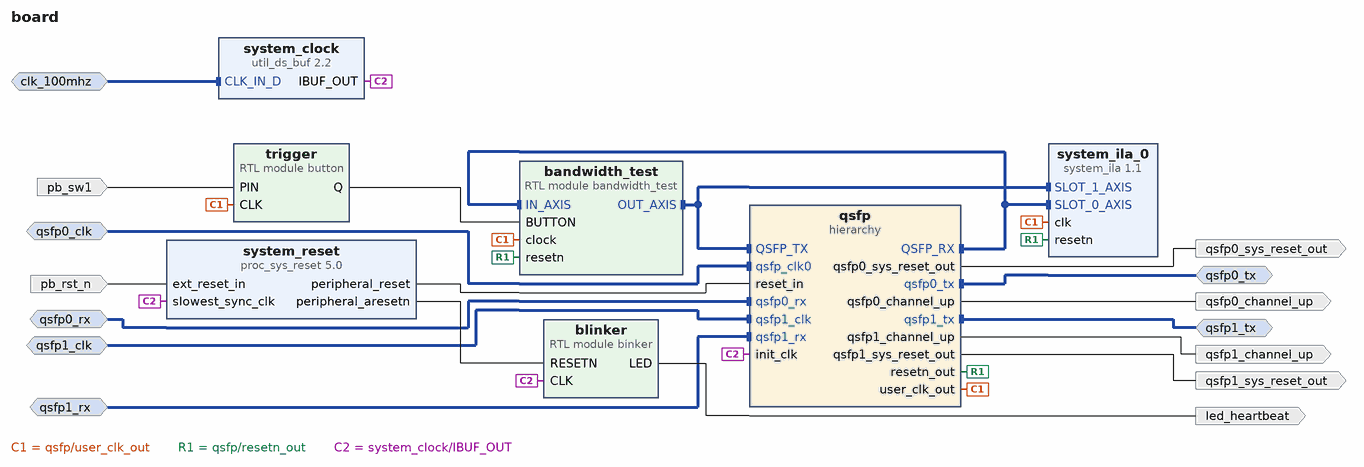
[diagram p0: block diagram of the top level]
# Vivado block design board, xczu19eg-ffvc1760-2-i, Vivado 2021.1
create_bd_design board

create_bd_intf_port -mode Slave -vlnv xilinx.com:interface:diff_clock_rtl:1.0 clk_100mhz
create_bd_intf_port -mode Slave -vlnv xilinx.com:interface:diff_clock_rtl:1.0 qsfp1_clk
set_property -dict {CONFIG.FREQ_HZ 322265625} [get_bd_intf_ports qsfp1_clk]
create_bd_intf_port -mode Slave -vlnv xilinx.com:display_aurora:GT_Serial_Transceiver_Pins_RX_rtl:1.0 qsfp1_rx
create_bd_intf_port -mode Master -vlnv xilinx.com:display_aurora:GT_Serial_Transceiver_Pins_TX_rtl:1.0 qsfp1_tx
create_bd_intf_port -mode Slave -vlnv xilinx.com:interface:diff_clock_rtl:1.0 qsfp0_clk
set_property -dict {CONFIG.FREQ_HZ 322265625} [get_bd_intf_ports qsfp0_clk]
create_bd_intf_port -mode Master -vlnv xilinx.com:display_aurora:GT_Serial_Transceiver_Pins_TX_rtl:1.0 qsfp0_tx
create_bd_intf_port -mode Slave -vlnv xilinx.com:display_aurora:GT_Serial_Transceiver_Pins_RX_rtl:1.0 qsfp0_rx
create_bd_port -dir O led_heartbeat
create_bd_port -dir I -type rst pb_rst_n
create_bd_port -dir O qsfp1_channel_up
create_bd_port -dir O -type rst qsfp1_sys_reset_out
set_property -dict {CONFIG.POLARITY ACTIVE_HIGH} [get_bd_ports qsfp1_sys_reset_out]
create_bd_port -dir O -type rst qsfp0_sys_reset_out
set_property -dict {CONFIG.POLARITY ACTIVE_HIGH} [get_bd_ports qsfp0_sys_reset_out]
create_bd_port -dir O qsfp0_channel_up
create_bd_port -dir I pb_sw1

create_bd_cell -type ip -vlnv xilinx.com:ip:util_ds_buf:2.2 system_clock
create_bd_cell -type module -reference binker blinker
create_bd_cell -type ip -vlnv xilinx.com:ip:proc_sys_reset:5.0 system_reset
create_bd_cell -type module -reference button trigger
create_bd_cell -type module -reference bandwidth_test bandwidth_test
create_bd_cell -type hier qsfp
create_bd_cell -type ip -vlnv xilinx.com:ip:system_ila:1.1 system_ila_0
set_property -dict [list \
  CONFIG.C_MON_TYPE INTERFACE \
  CONFIG.C_NUM_MONITOR_SLOTS 2 \
  CONFIG.C_SLOT_0_APC_EN 0 \
  CONFIG.C_SLOT_0_AXI_DATA_SEL 1 \
  CONFIG.C_SLOT_0_AXI_TRIG_SEL 1 \
  CONFIG.C_SLOT_0_INTF_TYPE xilinx.com:interface:axis_rtl:1.0 \
  CONFIG.C_SLOT_1_APC_EN 0 \
  CONFIG.C_SLOT_1_AXI_DATA_SEL 1 \
  CONFIG.C_SLOT_1_AXI_TRIG_SEL 1 \
  CONFIG.C_SLOT_1_INTF_TYPE xilinx.com:interface:axis_rtl:1.0 \
] [get_bd_cells system_ila_0]

# ---- hierarchy /qsfp ----
current_bd_instance /qsfp
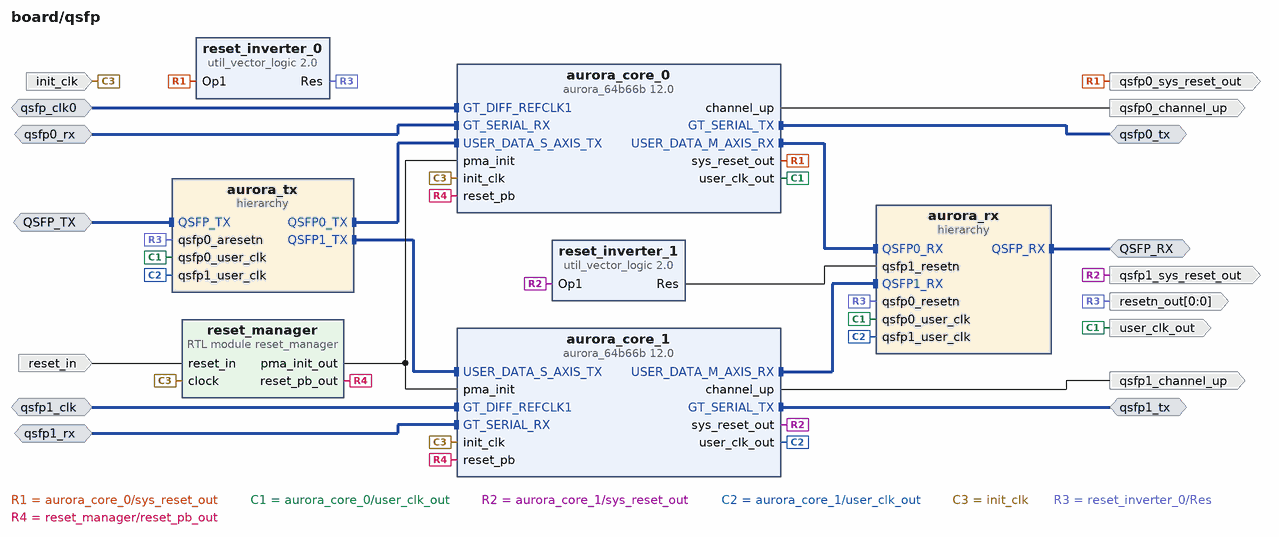
[diagram p1: block diagram inside /qsfp]
create_bd_intf_pin -mode Slave -vlnv xilinx.com:interface:diff_clock_rtl:1.0 qsfp_clk0
create_bd_intf_pin -mode Master -vlnv xilinx.com:display_aurora:GT_Serial_Transceiver_Pins_TX_rtl:1.0 qsfp0_tx
create_bd_intf_pin -mode Slave -vlnv xilinx.com:display_aurora:GT_Serial_Transceiver_Pins_RX_rtl:1.0 qsfp0_rx
create_bd_intf_pin -mode Master -vlnv xilinx.com:display_aurora:GT_Serial_Transceiver_Pins_TX_rtl:1.0 qsfp1_tx
create_bd_intf_pin -mode Slave -vlnv xilinx.com:display_aurora:GT_Serial_Transceiver_Pins_RX_rtl:1.0 qsfp1_rx
create_bd_intf_pin -mode Slave -vlnv xilinx.com:interface:diff_clock_rtl:1.0 qsfp1_clk
create_bd_intf_pin -mode Slave -vlnv xilinx.com:interface:axis_rtl:1.0 QSFP_TX
create_bd_intf_pin -mode Master -vlnv xilinx.com:interface:axis_rtl:1.0 QSFP_RX
create_bd_pin -dir I -type clk init_clk
create_bd_pin -dir O qsfp0_channel_up
create_bd_pin -dir O -type rst qsfp0_sys_reset_out
create_bd_pin -dir O -type clk user_clk_out
create_bd_pin -dir I -type rst reset_in
create_bd_pin -dir O -from 0 -to 0 resetn_out
create_bd_pin -dir O -type rst qsfp1_sys_reset_out
create_bd_pin -dir O qsfp1_channel_up

create_bd_cell -type ip -vlnv xilinx.com:ip:aurora_64b66b:12.0 aurora_core_0
set_property -dict [list \
  CONFIG.CHANNEL_ENABLE {X0Y12 X0Y13 X0Y14 X0Y15} \
  CONFIG.C_AURORA_LANES 4 \
  CONFIG.C_GT_CLOCK_1 GTYQ0 \
  CONFIG.C_GT_TYPE GTY \
  CONFIG.C_LINE_RATE 25.78125 \
  CONFIG.C_REFCLK_FREQUENCY 322.265625 \
  CONFIG.C_REFCLK_SOURCE MGTREFCLK0_of_Quad_X0Y3 \
  CONFIG.C_START_LANE X0Y12 \
  CONFIG.C_START_QUAD Quad_X0Y3 \
  CONFIG.C_UCOLUMN_USED left \
  CONFIG.SupportLevel 1 \
  CONFIG.drp_mode Disabled \
  CONFIG.interface_mode Streaming \
] [get_bd_cells aurora_core_0]
create_bd_cell -type module -reference reset_manager reset_manager
create_bd_cell -type ip -vlnv xilinx.com:ip:util_vector_logic:2.0 reset_inverter_0
set_property -dict {CONFIG.C_OPERATION not CONFIG.C_SIZE 1} [get_bd_cells reset_inverter_0]
create_bd_cell -type ip -vlnv xilinx.com:ip:aurora_64b66b:12.0 aurora_core_1
set_property -dict [list \
  CONFIG.CHANNEL_ENABLE {X0Y16 X0Y17 X0Y18 X0Y19} \
  CONFIG.C_AURORA_LANES 4 \
  CONFIG.C_GT_CLOCK_1 GTYQ0 \
  CONFIG.C_GT_TYPE GTY \
  CONFIG.C_LINE_RATE 25.78125 \
  CONFIG.C_REFCLK_FREQUENCY 322.265625 \
  CONFIG.C_REFCLK_SOURCE MGTREFCLK0_of_Quad_X0Y4 \
  CONFIG.C_START_LANE X0Y16 \
  CONFIG.C_START_QUAD Quad_X0Y4 \
  CONFIG.C_UCOLUMN_USED left \
  CONFIG.SupportLevel 1 \
  CONFIG.TransceiverControl false \
  CONFIG.drp_mode Disabled \
  CONFIG.interface_mode Streaming \
] [get_bd_cells aurora_core_1]
create_bd_cell -type ip -vlnv xilinx.com:ip:util_vector_logic:2.0 reset_inverter_1
set_property -dict {CONFIG.C_OPERATION not CONFIG.C_SIZE 1} [get_bd_cells reset_inverter_1]
create_bd_cell -type hier aurora_tx
create_bd_cell -type hier aurora_rx

# ---- hierarchy /qsfp/aurora_tx ----
current_bd_instance /qsfp/aurora_tx
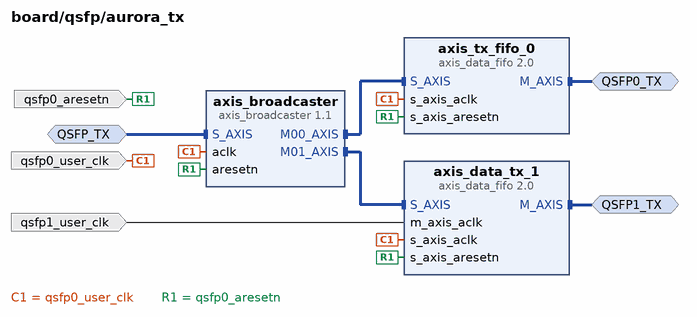
[diagram p2: block diagram inside /qsfp/aurora_tx]
create_bd_intf_pin -mode Master -vlnv xilinx.com:interface:axis_rtl:1.0 QSFP1_TX
create_bd_intf_pin -mode Master -vlnv xilinx.com:interface:axis_rtl:1.0 QSFP0_TX
create_bd_intf_pin -mode Slave -vlnv xilinx.com:interface:axis_rtl:1.0 QSFP_TX
create_bd_pin -dir I -type rst qsfp0_aresetn
create_bd_pin -dir I -type clk qsfp0_user_clk
create_bd_pin -dir I -type clk qsfp1_user_clk

create_bd_cell -type ip -vlnv xilinx.com:ip:axis_data_fifo:2.0 axis_data_tx_1
set_property -dict {CONFIG.IS_ACLK_ASYNC 1} [get_bd_cells axis_data_tx_1]
create_bd_cell -type ip -vlnv xilinx.com:ip:axis_data_fifo:2.0 axis_tx_fifo_0
create_bd_cell -type ip -vlnv xilinx.com:ip:axis_broadcaster:1.1 axis_broadcaster
set_property -dict [list \
  CONFIG.M00_TDATA_REMAP {tdata[511:256]} \
  CONFIG.M01_TDATA_REMAP {tdata[255:0]} \
  CONFIG.M_TDATA_NUM_BYTES 32 \
] [get_bd_cells axis_broadcaster]

# ---- hierarchy /qsfp/aurora_rx ----
current_bd_instance /qsfp/aurora_rx
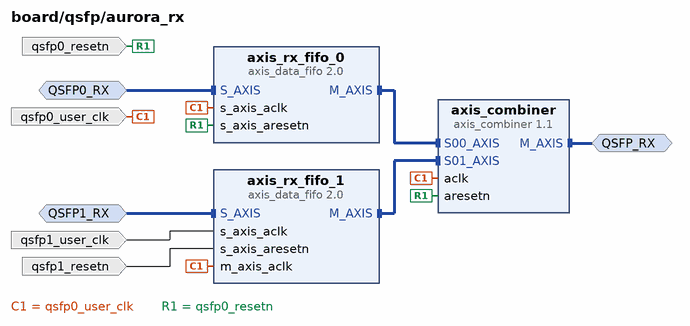
[diagram p3: block diagram inside /qsfp/aurora_rx]
create_bd_intf_pin -mode Master -vlnv xilinx.com:interface:axis_rtl:1.0 QSFP_RX
create_bd_intf_pin -mode Slave -vlnv xilinx.com:interface:axis_rtl:1.0 QSFP0_RX
create_bd_intf_pin -mode Slave -vlnv xilinx.com:interface:axis_rtl:1.0 QSFP1_RX
create_bd_pin -dir I -type clk qsfp0_user_clk
create_bd_pin -dir I -type rst qsfp0_resetn
create_bd_pin -dir I -type rst qsfp1_resetn
create_bd_pin -dir I -type clk qsfp1_user_clk

create_bd_cell -type ip -vlnv xilinx.com:ip:axis_combiner:1.1 axis_combiner
create_bd_cell -type ip -vlnv xilinx.com:ip:axis_data_fifo:2.0 axis_rx_fifo_0
create_bd_cell -type ip -vlnv xilinx.com:ip:axis_data_fifo:2.0 axis_rx_fifo_1
set_property -dict {CONFIG.IS_ACLK_ASYNC 1} [get_bd_cells axis_rx_fifo_1]

# ---- connections ----

current_bd_instance /qsfp
connect_bd_intf_net [get_bd_intf_pins qsfp_clk0] [get_bd_intf_pins aurora_core_0/GT_DIFF_REFCLK1]
connect_bd_intf_net -intf_net Conn2 [get_bd_intf_pins QSFP_TX] [get_bd_intf_pins aurora_tx/QSFP_TX]
connect_bd_intf_net -intf_net Conn3 [get_bd_intf_pins QSFP_RX] [get_bd_intf_pins aurora_rx/QSFP_RX]
connect_bd_intf_net [get_bd_intf_pins qsfp0_tx] [get_bd_intf_pins aurora_core_0/GT_SERIAL_TX]
connect_bd_intf_net [get_bd_intf_pins qsfp0_rx] [get_bd_intf_pins aurora_core_0/GT_SERIAL_RX]
connect_bd_intf_net [get_bd_intf_pins aurora_core_0/USER_DATA_M_AXIS_RX] [get_bd_intf_pins aurora_rx/QSFP0_RX]
connect_bd_intf_net [get_bd_intf_pins qsfp1_tx] [get_bd_intf_pins aurora_core_1/GT_SERIAL_TX]
connect_bd_intf_net [get_bd_intf_pins aurora_core_1/USER_DATA_M_AXIS_RX] [get_bd_intf_pins aurora_rx/QSFP1_RX]
connect_bd_intf_net [get_bd_intf_pins aurora_core_0/USER_DATA_S_AXIS_TX] [get_bd_intf_pins aurora_tx/QSFP0_TX]
connect_bd_intf_net [get_bd_intf_pins aurora_core_1/USER_DATA_S_AXIS_TX] [get_bd_intf_pins aurora_tx/QSFP1_TX]
connect_bd_intf_net [get_bd_intf_pins qsfp1_clk] [get_bd_intf_pins aurora_core_1/GT_DIFF_REFCLK1]
connect_bd_intf_net [get_bd_intf_pins qsfp1_rx] [get_bd_intf_pins aurora_core_1/GT_SERIAL_RX]
connect_bd_net -net aurora_64b66b_0_channel_up [get_bd_pins aurora_core_0/channel_up] [get_bd_pins qsfp0_channel_up]
connect_bd_net -net aurora_64b66b_0_sys_reset_out [get_bd_pins aurora_core_0/sys_reset_out] \
  [get_bd_pins qsfp0_sys_reset_out] [get_bd_pins reset_inverter_0/Op1]
connect_bd_net -net aurora_64b66b_0_user_clk_out [get_bd_pins aurora_core_0/user_clk_out] \
  [get_bd_pins user_clk_out] [get_bd_pins aurora_tx/qsfp0_user_clk] [get_bd_pins aurora_rx/qsfp0_user_clk]
connect_bd_net [get_bd_pins aurora_core_1/channel_up] [get_bd_pins qsfp1_channel_up]
connect_bd_net [get_bd_pins aurora_core_1/sys_reset_out] [get_bd_pins qsfp1_sys_reset_out] [get_bd_pins reset_inverter_1/Op1]
connect_bd_net [get_bd_pins aurora_core_1/user_clk_out] [get_bd_pins aurora_tx/qsfp1_user_clk] [get_bd_pins aurora_rx/qsfp1_user_clk]
connect_bd_net [get_bd_pins init_clk] [get_bd_pins aurora_core_0/init_clk] [get_bd_pins reset_manager/clock] [get_bd_pins aurora_core_1/init_clk]
connect_bd_net [get_bd_pins reset_in] [get_bd_pins reset_manager/reset_in]
connect_bd_net [get_bd_pins reset_inverter_1/Res] [get_bd_pins aurora_rx/qsfp1_resetn]
connect_bd_net -net reset_inverter_Res [get_bd_pins reset_inverter_0/Res] \
  [get_bd_pins resetn_out] [get_bd_pins aurora_tx/qsfp0_aresetn] [get_bd_pins aurora_rx/qsfp0_resetn]
connect_bd_net -net reset_manager_0_pma_init_out [get_bd_pins reset_manager/pma_init_out] \
  [get_bd_pins aurora_core_0/pma_init] [get_bd_pins aurora_core_1/pma_init]
connect_bd_net -net reset_manager_0_reset_pb_out [get_bd_pins reset_manager/reset_pb_out] \
  [get_bd_pins aurora_core_0/reset_pb] [get_bd_pins aurora_core_1/reset_pb]
set_property HDL_ATTRIBUTE.DEBUG true [get_bd_intf_nets Conn2]
set_property HDL_ATTRIBUTE.DEBUG true [get_bd_intf_nets Conn3]

current_bd_instance /qsfp/aurora_tx
connect_bd_intf_net -intf_net Conn1 [get_bd_intf_pins QSFP_TX] [get_bd_intf_pins axis_broadcaster/S_AXIS]
connect_bd_intf_net [get_bd_intf_pins QSFP0_TX] [get_bd_intf_pins axis_tx_fifo_0/M_AXIS]
connect_bd_intf_net [get_bd_intf_pins axis_tx_fifo_0/S_AXIS] [get_bd_intf_pins axis_broadcaster/M00_AXIS]
connect_bd_intf_net [get_bd_intf_pins axis_data_tx_1/S_AXIS] [get_bd_intf_pins axis_broadcaster/M01_AXIS]
connect_bd_intf_net [get_bd_intf_pins QSFP1_TX] [get_bd_intf_pins axis_data_tx_1/M_AXIS]
connect_bd_net -net qsfp0_user_clk_out [get_bd_pins qsfp0_user_clk] \
  [get_bd_pins axis_data_tx_1/s_axis_aclk] [get_bd_pins axis_tx_fifo_0/s_axis_aclk] [get_bd_pins axis_broadcaster/aclk]
connect_bd_net -net qsfp1_user_clk_out [get_bd_pins qsfp1_user_clk] [get_bd_pins axis_data_tx_1/m_axis_aclk]
connect_bd_net -net reset_inverter_Res [get_bd_pins qsfp0_aresetn] \
  [get_bd_pins axis_data_tx_1/s_axis_aresetn] [get_bd_pins axis_tx_fifo_0/s_axis_aresetn] \
  [get_bd_pins axis_broadcaster/aresetn]
set_property HDL_ATTRIBUTE.DEBUG true [get_bd_intf_nets Conn1]

current_bd_instance /qsfp/aurora_rx
connect_bd_intf_net [get_bd_intf_pins QSFP0_RX] [get_bd_intf_pins axis_rx_fifo_0/S_AXIS]
connect_bd_intf_net [get_bd_intf_pins QSFP1_RX] [get_bd_intf_pins axis_rx_fifo_1/S_AXIS]
connect_bd_intf_net -intf_net axis_combiner_0_M_AXIS [get_bd_intf_pins QSFP_RX] [get_bd_intf_pins axis_combiner/M_AXIS]
connect_bd_intf_net [get_bd_intf_pins axis_combiner/S00_AXIS] [get_bd_intf_pins axis_rx_fifo_0/M_AXIS]
connect_bd_intf_net [get_bd_intf_pins axis_combiner/S01_AXIS] [get_bd_intf_pins axis_rx_fifo_1/M_AXIS]
connect_bd_net -net qsfp0_user_clk_out [get_bd_pins qsfp0_user_clk] \
  [get_bd_pins axis_combiner/aclk] [get_bd_pins axis_rx_fifo_0/s_axis_aclk] [get_bd_pins axis_rx_fifo_1/m_axis_aclk]
connect_bd_net -net reset_inverter_Res [get_bd_pins qsfp0_resetn] [get_bd_pins axis_combiner/aresetn] [get_bd_pins axis_rx_fifo_0/s_axis_aresetn]
connect_bd_net -net s_axis_aclk_1 [get_bd_pins qsfp1_user_clk] [get_bd_pins axis_rx_fifo_1/s_axis_aclk]
connect_bd_net -net s_axis_aresetn_1 [get_bd_pins qsfp1_resetn] [get_bd_pins axis_rx_fifo_1/s_axis_aresetn]
set_property HDL_ATTRIBUTE.DEBUG true [get_bd_intf_nets axis_combiner_0_M_AXIS]

current_bd_instance /
connect_bd_intf_net -intf_net CLK_IN_D_0_1 [get_bd_intf_ports clk_100mhz] [get_bd_intf_pins system_clock/CLK_IN_D]
connect_bd_intf_net -intf_net bandwidth_test_OUT_AXIS [get_bd_intf_pins bandwidth_test/OUT_AXIS] [get_bd_intf_pins qsfp/QSFP_TX]
connect_bd_intf_net [get_bd_intf_pins bandwidth_test/OUT_AXIS] [get_bd_intf_pins system_ila_0/SLOT_1_AXIS]
connect_bd_intf_net [get_bd_intf_ports qsfp0_clk] [get_bd_intf_pins qsfp/qsfp_clk0]
connect_bd_intf_net -intf_net qsfp0_qsfp1_tx [get_bd_intf_ports qsfp1_tx] [get_bd_intf_pins qsfp/qsfp1_tx]
connect_bd_intf_net [get_bd_intf_ports qsfp0_rx] [get_bd_intf_pins qsfp/qsfp0_rx]
connect_bd_intf_net [get_bd_intf_ports qsfp1_clk] [get_bd_intf_pins qsfp/qsfp1_clk]
connect_bd_intf_net [get_bd_intf_ports qsfp1_rx] [get_bd_intf_pins qsfp/qsfp1_rx]
connect_bd_intf_net -intf_net qsfp_QSFP_RX [get_bd_intf_pins bandwidth_test/IN_AXIS] [get_bd_intf_pins qsfp/QSFP_RX]
connect_bd_intf_net [get_bd_intf_pins bandwidth_test/IN_AXIS] [get_bd_intf_pins system_ila_0/SLOT_0_AXIS]
connect_bd_intf_net -intf_net qsfp_data_qsfp0_tx [get_bd_intf_ports qsfp0_tx] [get_bd_intf_pins qsfp/qsfp0_tx]
connect_bd_net -net PIN_0_1 [get_bd_ports pb_sw1] [get_bd_pins trigger/PIN]
connect_bd_net -net aurora_64b66b_0_sys_reset_out [get_bd_pins qsfp/qsfp0_sys_reset_out] [get_bd_ports qsfp0_sys_reset_out]
connect_bd_net -net binker_0_LED [get_bd_pins blinker/LED] [get_bd_ports led_heartbeat]
connect_bd_net -net button_0_Q [get_bd_pins trigger/Q] [get_bd_pins bandwidth_test/BUTTON]
connect_bd_net -net ext_reset_in_0_1 [get_bd_ports pb_rst_n] [get_bd_pins system_reset/ext_reset_in]
# net gt_reset_out has one end: 
connect_bd_net -net qsfp0_channel_up_1 [get_bd_pins qsfp/qsfp1_channel_up] [get_bd_ports qsfp1_channel_up]
connect_bd_net -net qsfp0_sys_reset_out_1 [get_bd_pins qsfp/qsfp1_sys_reset_out] [get_bd_ports qsfp1_sys_reset_out]
connect_bd_net -net qsfp0_user_clk_out [get_bd_pins qsfp/user_clk_out] \
  [get_bd_pins trigger/CLK] [get_bd_pins bandwidth_test/clock] [get_bd_pins system_ila_0/clk]
connect_bd_net -net qsfp_data_channel_up_0 [get_bd_pins qsfp/qsfp0_channel_up] [get_bd_ports qsfp0_channel_up]
connect_bd_net -net reset_inverter_Res [get_bd_pins qsfp/resetn_out] [get_bd_pins bandwidth_test/resetn] [get_bd_pins system_ila_0/resetn]
connect_bd_net [get_bd_pins system_clock/IBUF_OUT] [get_bd_pins blinker/CLK] [get_bd_pins system_reset/slowest_sync_clk] [get_bd_pins qsfp/init_clk]
connect_bd_net [get_bd_pins system_reset/peripheral_aresetn] [get_bd_pins blinker/RESETN]
connect_bd_net [get_bd_pins system_reset/peripheral_reset] [get_bd_pins qsfp/reset_in]
set_property HDL_ATTRIBUTE.DEBUG true [get_bd_intf_nets bandwidth_test_OUT_AXIS]
set_property HDL_ATTRIBUTE.MARK_DEBUG true [get_bd_intf_nets bandwidth_test_OUT_AXIS]
set_property HDL_ATTRIBUTE.DEBUG true [get_bd_intf_nets qsfp_QSFP_RX]
set_property HDL_ATTRIBUTE.MARK_DEBUG true [get_bd_intf_nets qsfp_QSFP_RX]
set_property HDL_ATTRIBUTE.DEBUG true [get_bd_nets gt_reset_out]
set_property HDL_ATTRIBUTE.MARK_DEBUG true [get_bd_nets gt_reset_out]

validate_bd_design
save_bd_design
